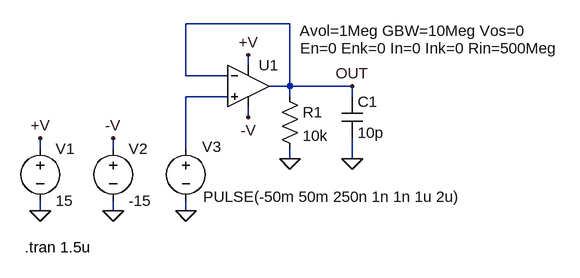
[diagram p0: schematic UniversalOpAmp1.asc]
UniversalOpAmp1.asc, the LTspice schematic file:
Version 4
SHEET 1 2580 1112
WIRE 560 560 400 560
WIRE 496 624 496 608
WIRE 400 640 400 560
WIRE 464 640 400 640
WIRE 560 656 560 560
WIRE 560 656 528 656
WIRE 656 656 560 656
WIRE 464 672 400 672
WIRE 560 672 560 656
WIRE 656 672 656 656
WIRE 496 704 496 688
WIRE 176 752 176 736
WIRE 288 752 288 736
WIRE 400 752 400 672
WIRE 560 768 560 752
WIRE 656 768 656 736
WIRE 176 848 176 832
WIRE 288 848 288 832
WIRE 400 848 400 832
FLAG 288 848 0
FLAG 176 848 0
FLAG 176 736 +V
FLAG 288 736 -V
FLAG 400 848 0
FLAG 496 704 -V
FLAG 496 608 +V
FLAG 656 768 0
FLAG 560 768 0
FLAG 656 656 OUT
SYMBOL voltage 176 736 R0
SYMATTR InstName V1
SYMATTR Value 15
SYMBOL voltage 288 736 R0
SYMATTR InstName V2
SYMATTR Value -15
SYMBOL voltage 400 736 R0
WINDOW 0 25 13 Left 2
WINDOW 3 27 90 Left 2
WINDOW 123 27 116 Left 2
WINDOW 39 0 0 Left 0
SYMATTR InstName V3
SYMATTR Value PULSE(-50m 50m 250n 1n 1n 1u 2u)
SYMBOL UniversalOpAmp1 496 656 R0
WINDOW 123 79 -85 Left 2
WINDOW 39 80 -58 Left 2
SYMATTR InstName U1
SYMBOL res 544 656 R0
SYMATTR InstName R1
SYMATTR Value 10k
SYMBOL cap 640 672 R0
SYMATTR InstName C1
SYMATTR Value 10p
TEXT 152 904 Left 2 !.tran 1.5u

The netlist it stands for:
* UniversalOpAmp1.asc
V1 +V 0 15
V2 -V 0 -15
V3 N001 0 PULSE(-50m 50m 250n 1n 1n 1u 2u)
XU1 N001 OUT +V -V OUT level1 Avol=1Meg GBW=10Meg Vos=0 En=0 Enk=0 In=0 Ink=0 Rin=500Meg  ; pins In+ In- V+ V- OUT
R1 OUT 0 10k
C1 OUT 0 10p
.tran 1.5u
.lib UniversalOpAmp1.lib
.backanno
.end